# Altium schematic sheet PowerBoardConnector.SchDoc
size A; DocumentNumber: 13; SheetNumber: 13
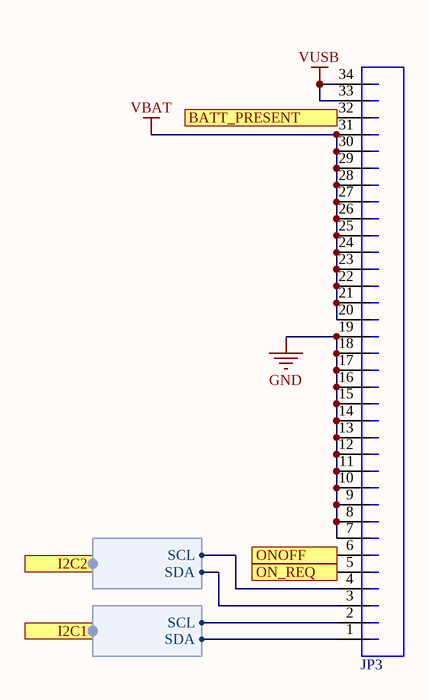
[diagram p0: PowerBoardConnector.SchDoc]

## Parts
JP3  MOLEX_FFC-FPC_34  [MOLEX-FFC-FPC-0.5MM-34]  (value not drawn)

## Ports
BATT_PRESENT (out), I2C1 (harness I2C), I2C2 (harness I2C), ON_REQ (in), ONOFF (out)

## Harnesses
I2C: SCL, SDA

## Nets
GND: JP3.7 JP3.8 JP3.9 JP3.10 JP3.11 JP3.12 JP3.13 JP3.14 JP3.15 JP3.16 JP3.17 JP3.18 JP3.19
VBAT: JP3.20 JP3.21 JP3.22 JP3.23 JP3.24 JP3.25 JP3.26 JP3.27 JP3.28 JP3.29 JP3.30 JP3.31
VUSB: JP3.33 JP3.34
BATT_PRESENT: JP3.32 ; port BATT_PRESENT
ON_REQ: JP3.5 ; port ON_REQ
ONOFF: JP3.6 ; port ONOFF
NetJP3_1: JP3.1 ; port I2C1.SDA
NetJP3_2: JP3.2 ; port I2C1.SCL
NetJP3_3: JP3.3 ; port I2C2.SDA
NetJP3_4: JP3.4 ; port I2C2.SCL

## Library data of the parts
JP3 = MOLEX_FFC-FPC_34: Manufacturer: Molex; PartNumber: 51296-3494; PackageReference: FFC-FPC-0.5; Mounting Technology: Surface Mount